# EasyEDA Pro project ProPrj_基于STM32的多功能串口分析仪_2025-03-12.epro, schematic Schematic4
Board Name: Board1; Create Date: 2025-03-12; Page Name: P1; Project Name: 基于STM32的多功能串口分析仪; Schematic Name: Schematic4; Update Date: 2025-03-12; Company: 嘉立创EDA; Page Size: A4; Version: V1.0
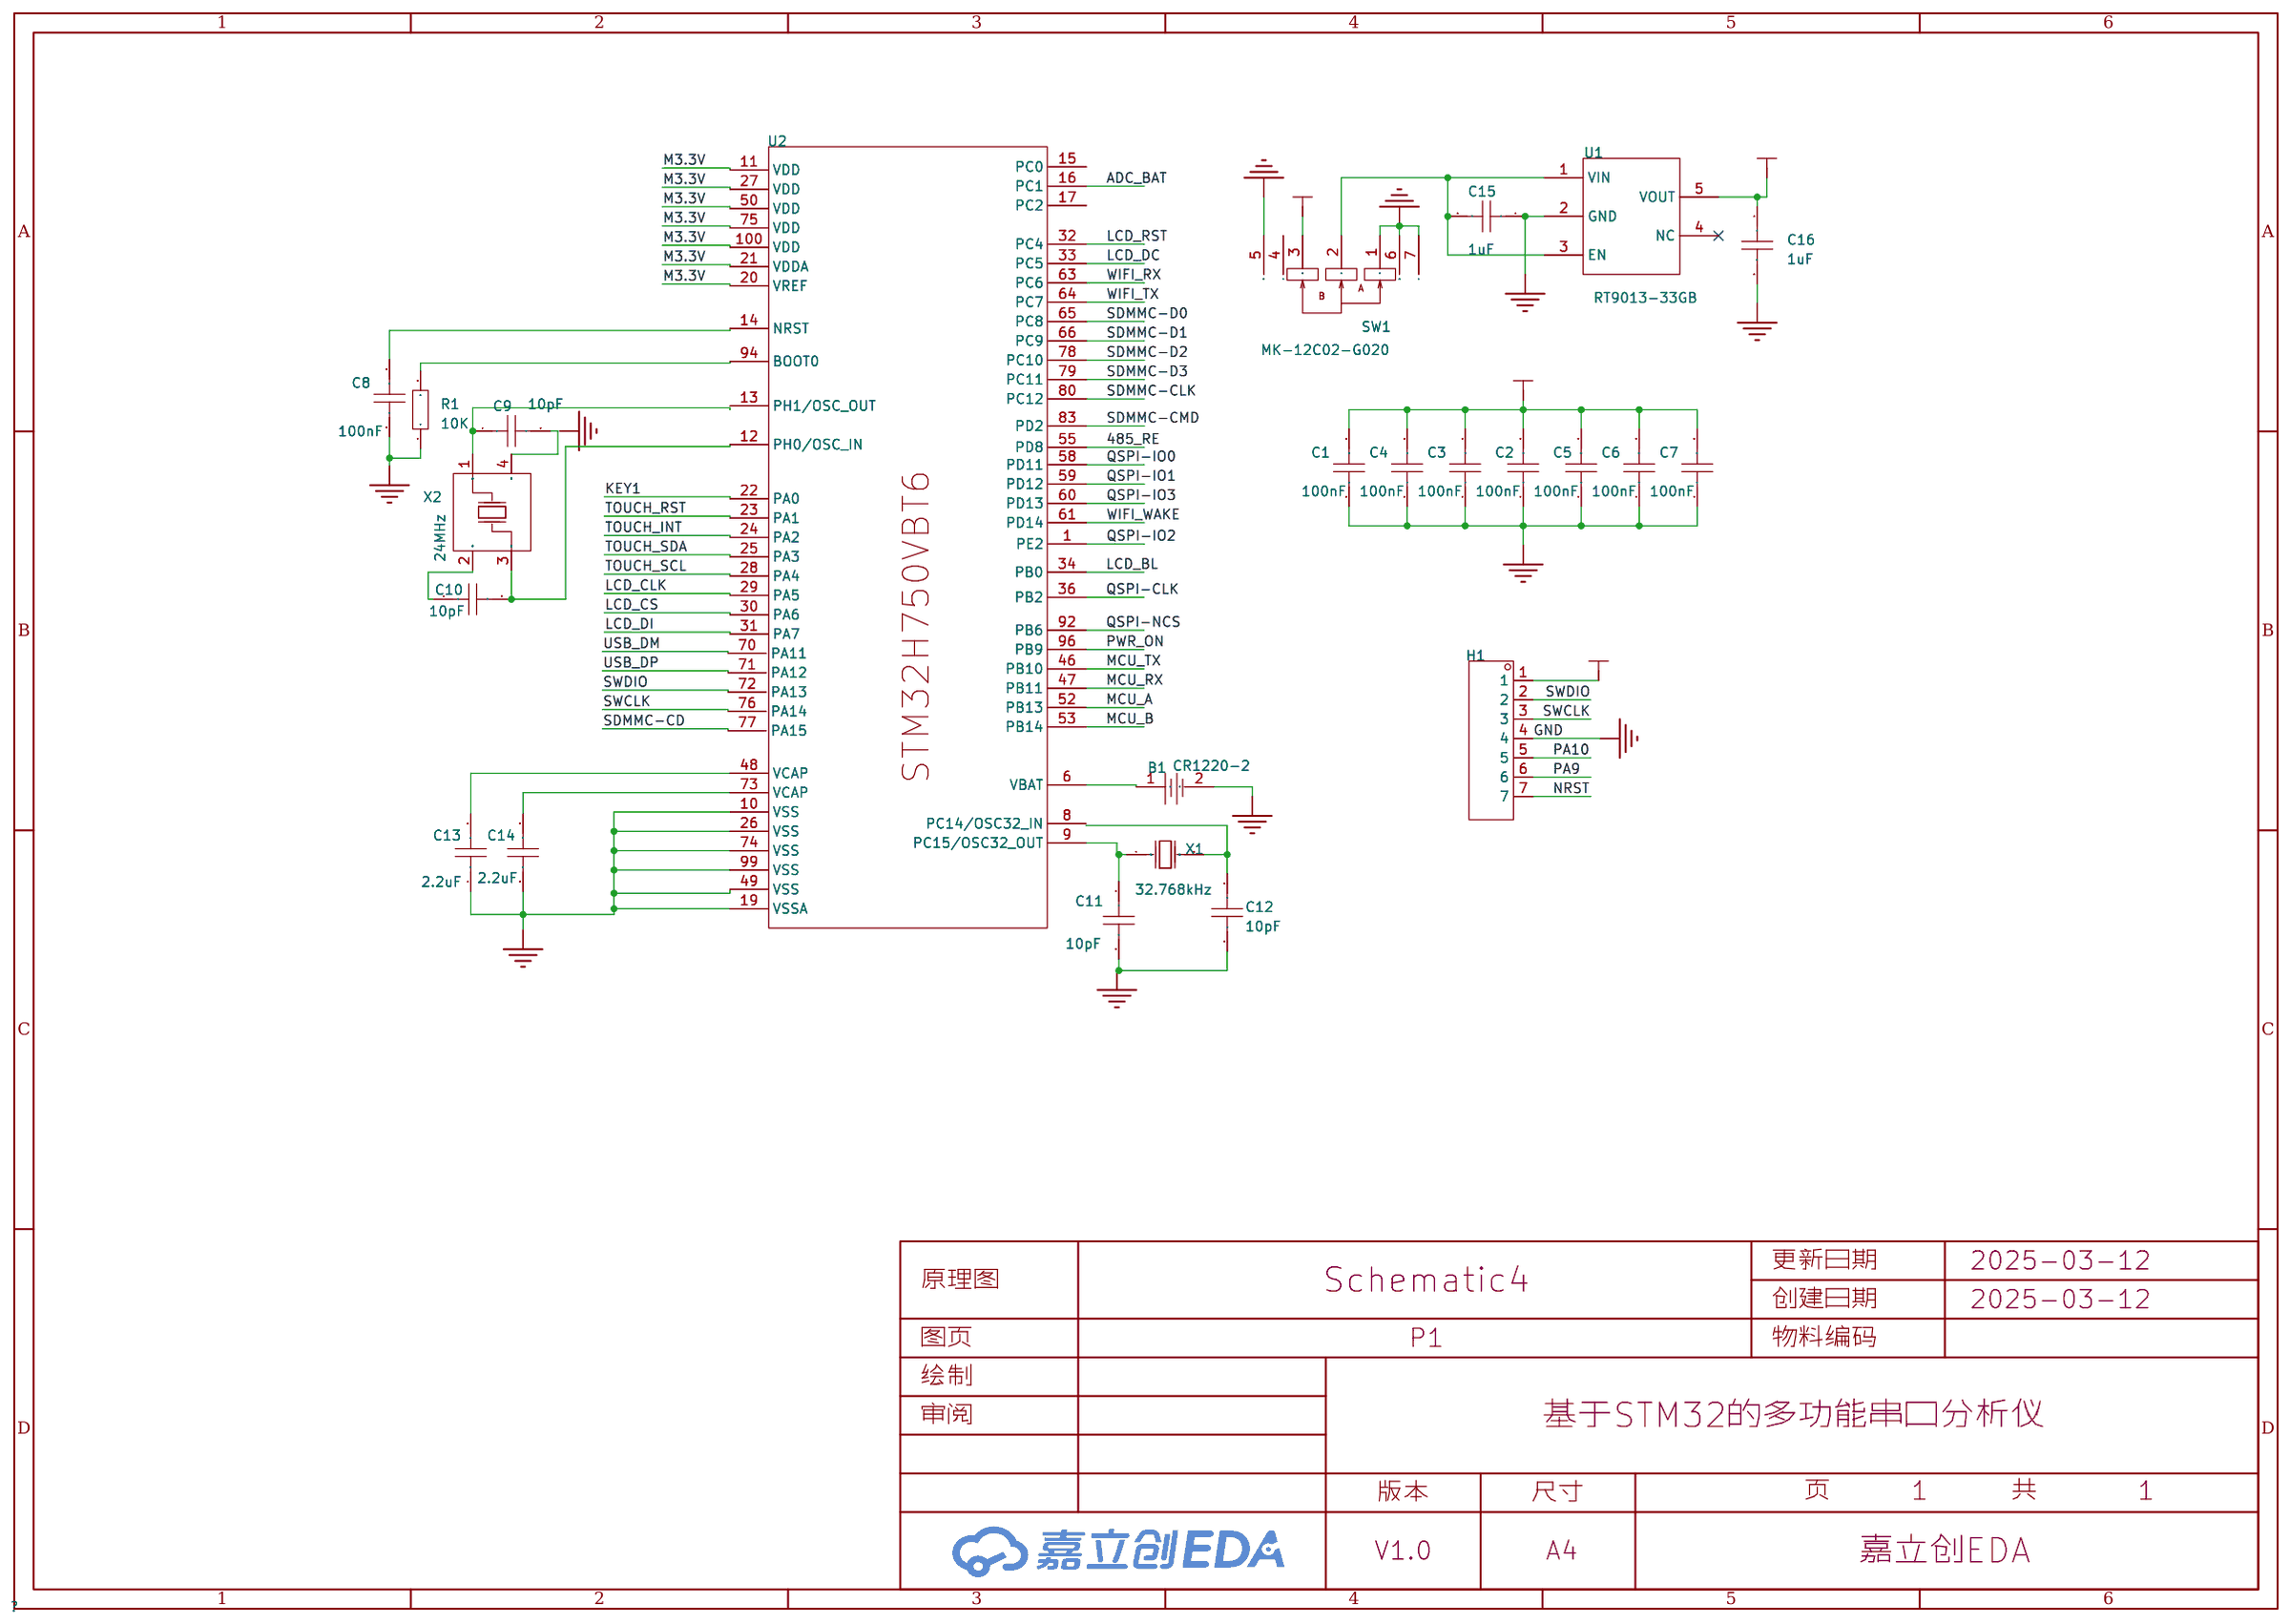
[diagram p8: schematic sheet]

## Parts
B1  CR1220-2  [BAT-SMD_CR1220-2]
C1  100nF  [C0603]
C2  100nF  [C0603]
C3  100nF  [C0603]
C4  100nF  [C0603]
C5  100nF  [C0603]
C6  100nF  [C0603]
C7  100nF  [C0603]
C8  100nF  [C0603]
C9  10pF  [C0603]
C10  10pF  [C0603]
C11  10pF  [C0603]
C12  10pF  [C0603]
C13  2.2uF  [C0603]
C14  2.2uF  [C0603]
C15  1uF  [C0603]
C16  1uF  [C0603]
H1  -  [HDR-TH_7P-P2.54-V-F]
R1  10K  [R0603]
SW1  MK-12C02-G020  [SW-SMD_MK-12C02-G020]
U1  RT9013-33GB  [SOT-23-5_L3.0-W1.7-P0.95-LS2.8-BL]
U2  -
X1  32.768kHz  [CRYSTAL-SMD_L3.2-W1.5-1]
X2  24MHz  [CRYSTAL-SMD_4P-L3.2-W2.5-BL]

## Library data of the parts
B1 = CR1220-2: 连接器类型:电池底座;适用电池规格:CR1220;工作温度范围:-;; LCSC Part Name: 电池底座 适用电池:CR1220; Supplier Part: C70381; Manufacturer: Q&J; Supplier Footprint: SMD; Datasheet: https://atta.szlcsc.com/upload/public/pdf/source/20160427/1461725216696.pdf; Supplier: LCSC; Connector Type: 电池底座; Battery Type: CR1220
C1-C16 = CAP_0603: Supplier Footprint: 0603
H1 = HDR-F_2.54_1x7P: Supplier Part: C124418; Supplier Footprint: 插件
R1 = Res_0603: Supplier Footprint: 0603
SW1 = MK-12C02-G020: 电路结构:单刀双掷;安装方式:卧贴;开关颜色:黑色;额定电流(DC):1A;额定电压(DC):6V;机械寿命:1万次;; LCSC Part Name: 微型拨动开关; Supplier Part: C963206; Manufacturer: G-Switch(品赞); Supplier Footprint: SMD; Datasheet: https://atta.szlcsc.com/upload/public/pdf/source/20200902/C778186_2AF08473ED98414D93A175E8814EEFA6.pdf; Supplier: LCSC; Circuit: 单刀双掷; Actuator Style: 矩形柱状; Pin Style: SMD接片; Switch Length: 6.6mm; Switch Width: 2.7mm; Switch Height: 4.7mm; Mounting Style: 卧贴; Actuator Color: 黑色; Current Rating (DC): 1A; Voltage Rating (DC): 6V; Mechanical Life: 1万次; Operating Temperature: -20℃~+70℃
U1 = RT9013-33GB: 输出类型:固定;最大输入电压:5.5V;输出电压:3.3V;最大输出电流:500mA;电源纹波抑制比(PSRR):50dB@(10kHz);输出极性:正极;; LCSC Part Name: 输入5.5V 输出3.3V 500mA; Supplier Part: C47773; Manufacturer: RICHTEK(立锜); Supplier Footprint: SOT-23-5; Datasheet: https://atta.szlcsc.com/upload/public/pdf/source/20150504/1457707282459.pdf; Supplier: LCSC; Output Type: 固定; Maximum Input Voltage: 5.5V; Output Voltage: 3.3V; MAX Output Current: 500mA; Power Supply Rejection Ratio (PSRR): 50dB@(10kHz); Dropout Voltage: 400mV@(500mA); standby current: 50uA; Operating Temperature: -40℃~+85℃; Output Polarity: 正极; Number of Outputs: 1
U2 = dsdsd
X1 = XKXGI-SUA-32.768K: 晶振类型:贴片晶振;频率:32.768kHz;常温频差:±20ppm;外接负载电容:12.5pF;频率稳定度(全温):±30ppm;; LCSC Part Name: 32.768kHz ±20ppm 12.5pF YST310S; Supplier Part: C5213671; Manufacturer: YXC(扬兴晶振); Supplier Footprint: SMD3215-2P; Datasheet: https://atta.szlcsc.com/upload/public/pdf/source/20240329/3A7650FD985DD0DE85694D3785AB4916.pdf; Supplier: LCSC; Crystal Type: 贴片晶振; Normal temperature Frequency Tolerance: ±20ppm; External load capacitor: 12.5pF; Frequency Stability(Full temperature range): ±30ppm; Operating Temperature: -40℃~+85℃
X2 = X322524MOB4SI: 晶振类型:贴片晶振;频率:24MHz;常温频差:±10ppm;外接负载电容:12pF;频率稳定度(全温):±20ppm;; LCSC Part Name: 24MHz ±10ppm 12pF; Supplier Part: C70590; Manufacturer: YXC(扬兴晶振); Supplier Footprint: SMD3225-4P; JLCPCB Part Class: Extended Part; Datasheet: https://atta.szlcsc.com/upload/public/pdf/source/20240329/19D5F850207469550BEB00D7DFEDBC7A.pdf; Supplier: LCSC; Crystal Type: 贴片晶振; Normal temperature Frequency Tolerance: ±10ppm; External load capacitor: 12pF; Frequency Stability(Full temperature range): ±20ppm; Operating Temperature: -40℃~+85℃

## Nets
GND: B1.2 C1.1 C2.1 C3.1 C4.1 C5.1 C6.1 C7.1 C8.2 C11.2 C12.2 C13.1 C14.1 C15.1 C16.2 H1.4 R1.1 SW1.1 SW1.5 SW1.6 SW1.7 U1.2(GND) U2.10(VSS) U2.19(VSSA) U2.26(VSS) U2.49(VSS) U2.74(VSS) U2.99(VSS)
485_RE: U2.55(PD8)
ADC_BAT: U2.16(PC1)
KEY1: U2.22(PA0)
LCD_BL: U2.34(PB0)
LCD_CLK: U2.29(PA5)
LCD_CS: U2.30(PA6)
LCD_DC: U2.33(PC5)
LCD_DI: U2.31(PA7)
LCD_RST: U2.32(PC4)
M3.3V: C1.2 C2.2 C3.2 C4.2 C5.2 C6.2 C7.2 C16.1 H1.1 SW1.3 U1.5(VOUT) U2.11(VDD) U2.20(VREF) U2.21(VDDA) U2.27(VDD) U2.50(VDD) U2.75(VDD) U2.100(VDD)
MCU_A: U2.52(PB13)
MCU_B: U2.53(PB14)
MCU_RX: U2.47(PB11)
MCU_TX: U2.46(PB10)
NRST: H1.7
PA9: H1.6
PA10: H1.5
PWR_ON: U2.96(PB9)
QSPI-CLK: U2.36(PB2)
QSPI-IO0: U2.58(PD11)
QSPI-IO1: U2.59(PD12)
QSPI-IO2: U2.1(PE2)
QSPI-IO3: U2.60(PD13)
QSPI-NCS: U2.92(PB6)
SDMMC-CD: U2.77(PA15)
SDMMC-CLK: U2.80(PC12)
SDMMC-CMD: U2.83(PD2)
SDMMC-D0: U2.65(PC8)
SDMMC-D1: U2.66(PC9)
SDMMC-D2: U2.78(PC10)
SDMMC-D3: U2.79(PC11)
SWCLK: H1.3 U2.76(PA14)
SWDIO: H1.2 U2.72(PA13)
TOUCH_INT: U2.24(PA2)
TOUCH_RST: U2.23(PA1)
TOUCH_SCL: U2.28(PA4)
TOUCH_SDA: U2.25(PA3)
USB_DM: U2.70(PA11)
USB_DP: U2.71(PA12)
WIFI_RX: U2.63(PC6)
WIFI_TX: U2.64(PC7)
WIFI_WAKE: U2.61(PD14)
Net-(B1-1): B1.1 U2.6(VBAT)
Net-(C8-1): C8.1 U2.14(NRST)
Net-(C9-1): C9.1 X2.1(OSC1)
Net-(C9-2): C9.2 X2.4(GND)
Net-(C10-1): C10.1 X2.2(GND)
Net-(C10-2): C10.2 U2.12(PH0/OSC_IN) X2.3(OSC2)
Net-(C11-1): C11.1 U2.9(PC15/OSC32_OUT) X1.1(OSC1)
Net-(C12-1): C12.1 X1.2(OSC2)
Net-(C13-2): C13.2 U2.48(VCAP)
Net-(C14-2): C14.2 U2.73(VCAP)
Net-(C15-2): C15.2 SW1.2 U1.1(VIN) U1.3(EN)
Net-(R1-2): R1.2 U2.94(BOOT0)

Not connected (* = marked no-connect by the designer): SW1 4; U1 4(NC)*; U2 8(PC14/OSC32_IN) 13(PH1/OSC_OUT) 15(PC0) 17(PC2)
